# EAGLE design version1 (EAGLE 9.6.2)
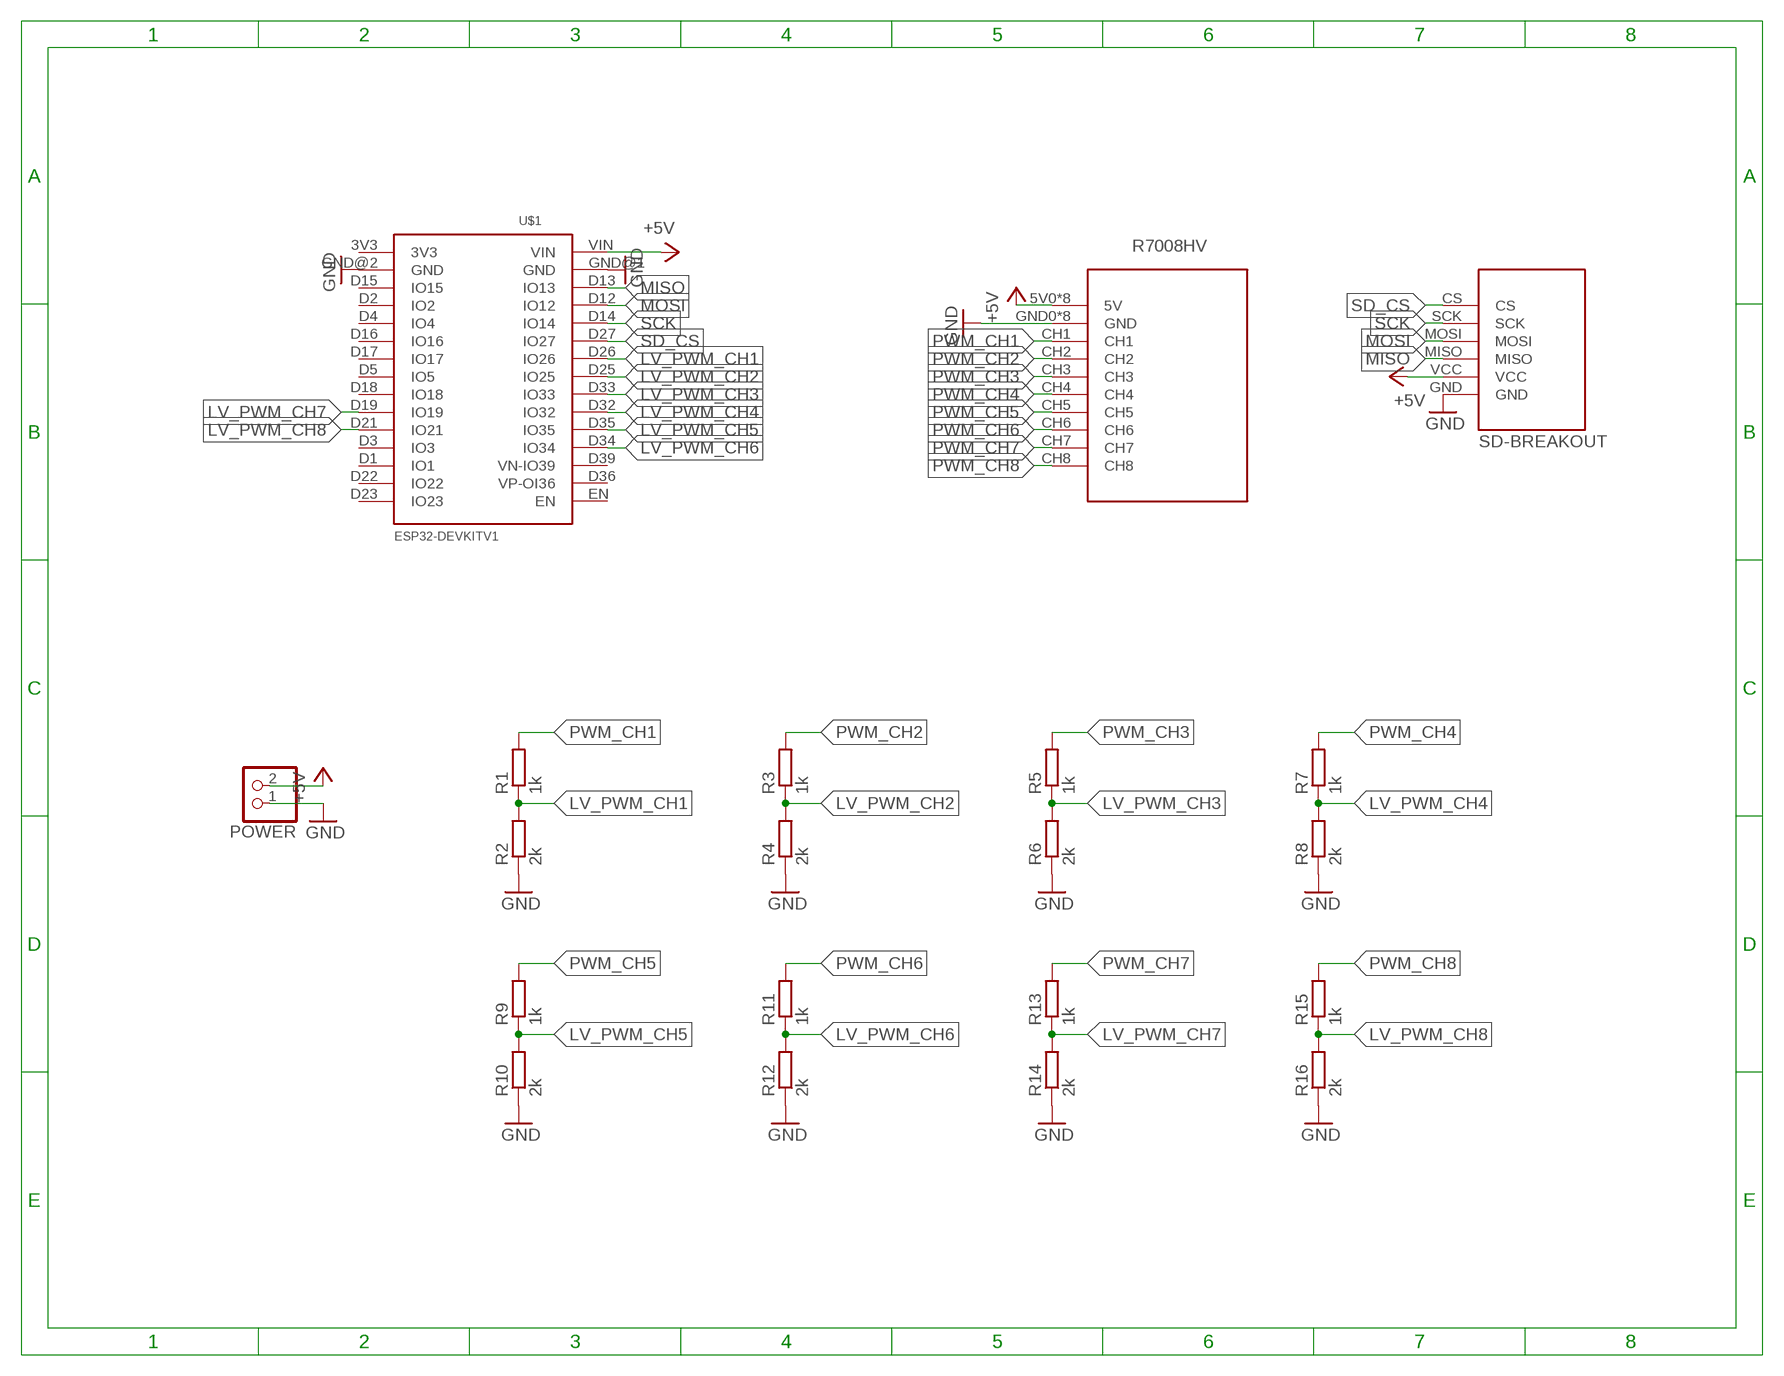
[diagram p0: schematic, sheet 1]

## Parts
POWER  PINHD-1X2  [1X02]
R1  1k  R-EU_0207/7  [0207/7]
R2  2k  R-EU_0207/7  [0207/7]
R3  1k  R-EU_0207/7  [0207/7]
R4  2k  R-EU_0207/7  [0207/7]
R5  1k  R-EU_0207/7  [0207/7]
R6  2k  R-EU_0207/7  [0207/7]
R7  1k  R-EU_0207/7  [0207/7]
R8  2k  R-EU_0207/7  [0207/7]
R9  1k  R-EU_0207/7  [0207/7]
R10  2k  R-EU_0207/7  [0207/7]
R11  1k  R-EU_0207/7  [0207/7]
R12  2k  R-EU_0207/7  [0207/7]
R13  1k  R-EU_0207/7  [0207/7]
R14  2k  R-EU_0207/7  [0207/7]
R15  1k  R-EU_0207/7  [0207/7]
R16  2k  R-EU_0207/7  [0207/7]
U$1  ESP32DEVKITV1  [ESP32-DEVKITV1]
U$2  HKD-MICRO-SD-BREAKOUTV  [HKD-MICRO-SD-BREAKOUT-VERTICAL]
U$3  R7008HV  [R7008HV]

## Nets
+5V: POWER.2 U$1.VIN U$2.VCC U$3.5V0(5V) U$3.5V1(5V) U$3.5V2(5V) U$3.5V3(5V) U$3.5V4(5V) U$3.5V5(5V) U$3.5V6(5V) U$3.5V7(5V)
GND: POWER.1 R2.1 R4.1 R6.1 R8.1 R10.1 R12.1 R14.1 R16.1 U$1.GND@1(GND) U$1.GND@2(GND) U$2.GND U$3.GND0(GND) U$3.GND1(GND) U$3.GND2(GND) U$3.GND3(GND) U$3.GND4(GND) U$3.GND5(GND) U$3.GND6(GND) U$3.GND7(GND)
LV_PWM_CH1: R1.1 R2.2 U$1.D26(IO26)
LV_PWM_CH2: R3.1 R4.2 U$1.D25(IO25)
LV_PWM_CH3: R5.1 R6.2 U$1.D33(IO33)
LV_PWM_CH4: R7.1 R8.2 U$1.D32(IO32)
LV_PWM_CH5: R9.1 R10.2 U$1.D35(IO35)
LV_PWM_CH6: R11.1 R12.2 U$1.D34(IO34)
LV_PWM_CH7: R13.1 R14.2 U$1.D19(IO19)
LV_PWM_CH8: R15.1 R16.2 U$1.D21(IO21)
MISO: U$1.D13(IO13) U$2.MISO
MOSI: U$1.D12(IO12) U$2.MOSI
PWM_CH1: R1.2 U$3.CH1
PWM_CH2: R3.2 U$3.CH2
PWM_CH3: R5.2 U$3.CH3
PWM_CH4: R7.2 U$3.CH4
PWM_CH5: R9.2 U$3.CH5
PWM_CH6: R11.2 U$3.CH6
PWM_CH7: R13.2 U$3.CH7
PWM_CH8: R15.2 U$3.CH8
SCK: U$1.D14(IO14) U$2.SCK
SD_CS: U$1.D27(IO27) U$2.CS
Unconnected: U$1.3V3 U$1.D1(IO1) U$1.D2(IO2) U$1.D3(IO3) U$1.D4(IO4) U$1.D5(IO5) U$1.D15(IO15) U$1.D16(IO16) U$1.D17(IO17) U$1.D18(IO18) U$1.D22(IO22) U$1.D23(IO23) U$1.D36(VP-OI36) U$1.D39(VN-IO39) U$1.EN

## Library data of the parts
POWER = pinhead:PINHD-1X2: PIN HEADER
R1-R16 = rcl:R-EU_: RESISTOR, European symbol; SPICEPREFIX: R
U$1 = ESP32-DEVKITV1:ESP32DEVKITV1
U$2 = sd-mmc:HKD-MICRO-SD-BREAKOUT
U$3 = radio-controllers:R7008HV

## Board
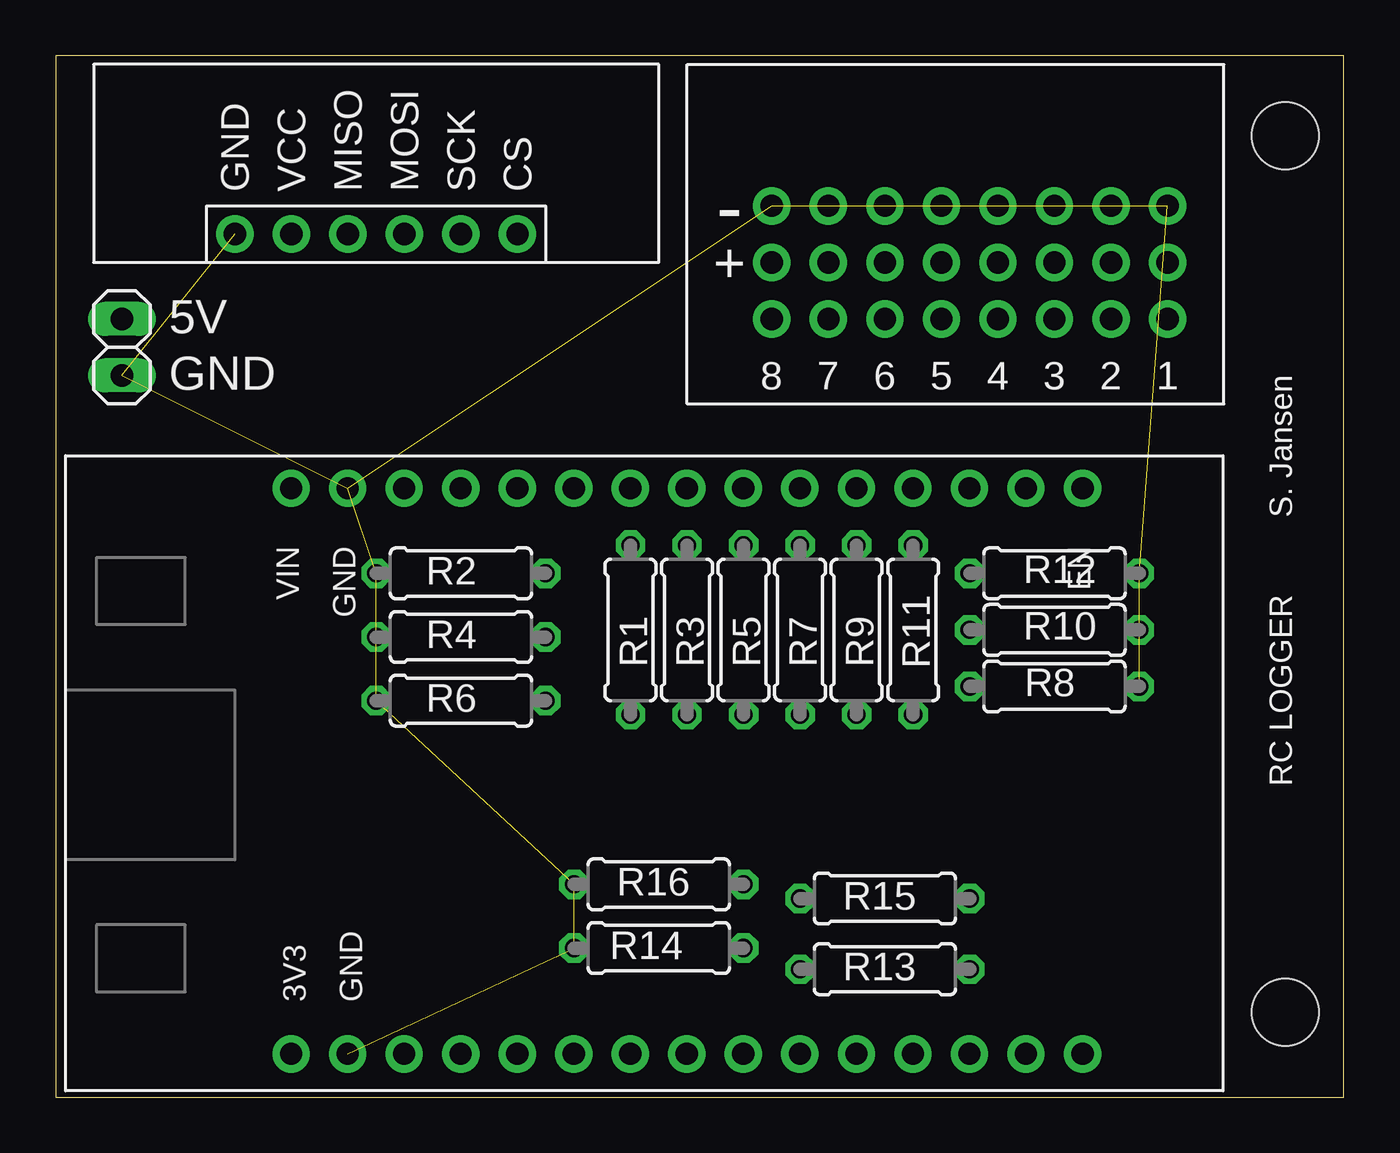
[diagram p1: board, top side]
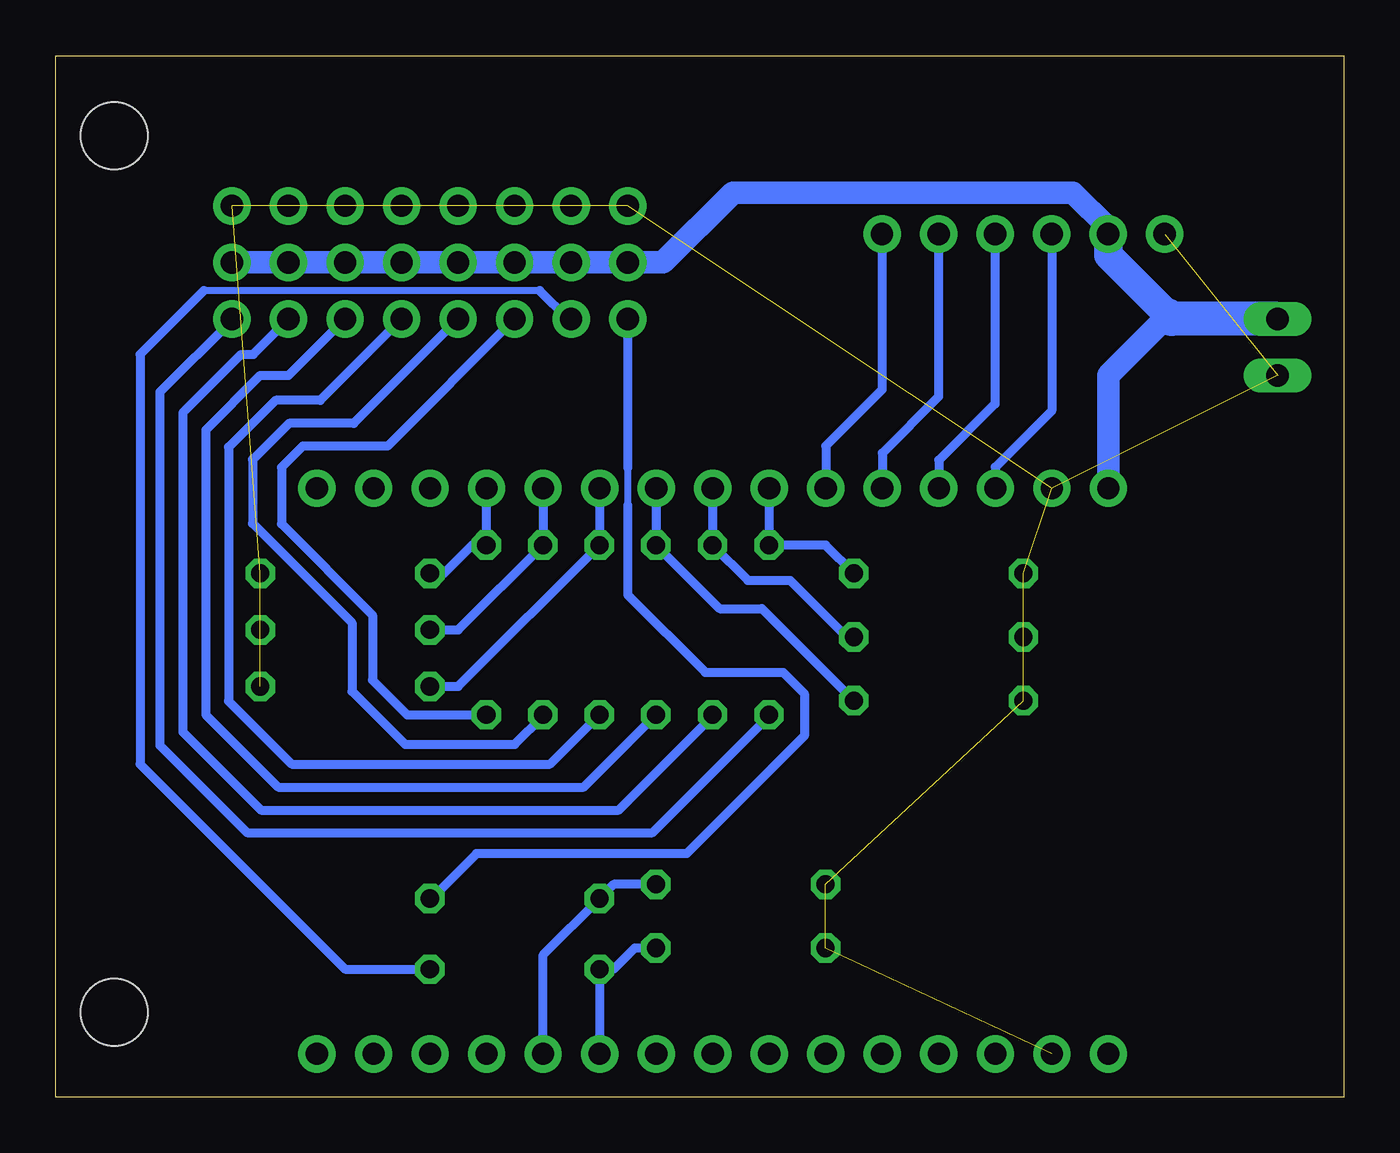
[diagram p2: board, bottom side, seen from below]

Size 57.89 x 46.78 mm. Coordinates in mm from the lower left corner, seen from the top.
Outline: 0,0 57.89,0 57.89,46.78 0,46.78 0,0
Copper layers (1*16): Top 0.035mm / dielectric 1.5mm / Bottom 0.035mm
Design rules "default *": minimum track width 8mil, minimum drill 0.35mm, track to track 8mil, track to pad 8mil, pad to pad 8mil, via to via 8mil, smd to smd 6mil, copper to edge 8mil, drill to drill 8mil, minimum pad ring 10mil, minimum via ring 8mil, stop-mask expansion 4mil, vias tented up to drill 0mil, thermal gap 10mil
Holes 3 mm at 55.24,43.18 55.24,3.81

### Footprints (pad centres in the part's own frame; a part is rotated, then mirrored left to right if it is on the bottom)
1X02 = drill 1.016 long: 1 -1.27,0; 2 1.27,0
0207/7 = drill 0.813 octagon: 1 -3.81,0; 2 3.81,0
ESP32-DEVKITV1 = drill 1 pad 1.676: 3V3 -15.25,-12.54; D1 15.23,-12.54; D2 -7.63,-12.54; D3 12.69,-12.54; D4 -5.09,-12.54; D5 2.53,-12.54; D12 -7.63,12.865; D13 -10.17,12.865; D14 -5.09,12.865; D15 -10.17,-12.54; D16 -2.55,-12.54; D17 -0.01,-12.54; D18 5.07,-12.54; D19 7.61,-12.54; D21 10.15,-12.54; D22 17.77,-12.54; D23 20.31,-12.54; D25 2.53,12.865; D26 -0.01,12.865; D27 -2.55,12.865; D32 7.61,12.865; D33 5.07,12.865; D34 12.69,12.865; D35 10.15,12.865; D36 17.77,12.865; D39 15.23,12.865; EN 20.31,12.865; GND@1 -12.71,12.865; GND@2 -12.71,-12.54; VIN -15.25,12.865
HKD-MICRO-SD-BREAKOUT-VERTICAL = drill 1 pad 1.676: CS -3.81,-6.35; GND -3.81,6.35; MISO -3.81,1.27; MOSI -3.81,-1.27; SCK -3.81,-3.81; VCC -3.81,3.81
R7008HV = drill 1 pad 1.676: 5V0 8.89,-1.27; 5V1 6.35,-1.27; 5V2 3.81,-1.27; 5V3 1.27,-1.27; 5V4 -1.27,-1.27; 5V5 -3.81,-1.27; 5V6 -6.35,-1.27; 5V7 -8.89,-1.27; CH1 8.89,-3.81; CH2 6.35,-3.81; CH3 3.81,-3.81; CH4 1.27,-3.81; CH5 -1.27,-3.81; CH6 -3.81,-3.81; CH7 -6.35,-3.81; CH8 -8.89,-3.81; GND0 8.89,1.27; GND1 6.35,1.27; GND2 3.81,1.27; GND3 1.27,1.27; GND4 -1.27,1.27; GND5 -3.81,1.27; GND6 -6.35,1.27; GND7 -8.89,1.27

### Placement (x,y rotation side)
POWER  2.97,33.68 90 top
R1  25.83,20.98 270 top
R2  18.21,23.52 0 top
R3  28.37,20.98 270 top
R4  18.21,20.66 0 top
R5  30.91,20.98 270 top
R6  18.21,17.81 0 top
R7  33.45,20.98 270 top
R8  44.88,18.44 180 top
R9  35.99,20.98 270 top
R10  44.88,20.98 180 top
R11  38.53,20.98 270 top
R12  44.88,23.52 180 top
R13  37.26,5.74 0 top
R14  27.1,6.69 0 top
R15  37.26,8.92 0 top
R16  27.1,9.55 0 top
U$1  25.83,14.48 0 top
U$2  14.4,42.57 90 top
U$3  41.07,38.76 0 top

### Tracks (layer width: path | path; a pad name or v marks a point on that pad's centre or on a via)
+5V
  Bottom 1.016: U$1.VIN 10.58,32.42 7.89,35.11 | U$2.VCC 10.59,39.05 12.17,40.63 27.46,40.63 30.59,37.49 U$3.5V7 U$3.5V6 U$3.5V5 U$3.5V4 U$3.5V3 U$3.5V2 U$3.5V1 U$3.5V0
  Bottom 1.27: U$2.VCC 10.59,37.81 7.89,35.11
  Bottom 1.524: 7.89,35.11 7.73,34.95 POWER.2
GND  (19 unrouted)
LV_PWM_CH1
  Bottom 0.406: U$1.D26 25.83,27.33 R1.1 23.29,24.79 R2.2
LV_PWM_CH2
  Bottom 0.406: U$1.D25 28.37,27.33 R3.1 26.78,23.2 24.88,23.2 22.34,20.66 R4.2
LV_PWM_CH3
  Bottom 0.406: U$1.D33 30.91,27.33 R5.1 28.05,21.93 26.15,21.93 R6.2
LV_PWM_CH4
  Bottom 0.406: U$1.D32 33.45,27.33 R7.1 39.8,18.44 R8.2
LV_PWM_CH5
  Bottom 0.406: U$1.D35 35.99,27.33 R9.1 39.8,20.98 R10.2
LV_PWM_CH6
  Bottom 0.406: R12.2 40.44,23.52 39.17,24.79 R11.1 U$1.D34
LV_PWM_CH7
  Bottom 0.406: R14.2 31.86,6.69 32.82,5.74 R13.1 33.45,1.95 U$1.D19
LV_PWM_CH8
  Bottom 0.406: R16.2 32.82,9.55 R15.1 35.98,6.38 U$1.D21
MISO
  Bottom 0.406: U$2.MISO 13.13,30.82 15.66,28.29 U$1.D13
MOSI
  Bottom 0.406: U$2.MOSI 15.67,31.14 18.2,28.61 U$1.D12
PWM_CH1
  Bottom 0.406: U$3.CH1 49.96,34.9 53.2,31.66 53.2,15.79 49.28,11.87 31.06,11.87 25.83,17.11 R1.2
PWM_CH2
  Bottom 0.406: U$3.CH2 49.01,33.36 49.54,33.36 52.17,30.73 52.17,16.4 48.66,12.89 32.59,12.89 28.37,17.11 R3.2
PWM_CH3
  Bottom 0.406: U$3.CH3 47.42,32.41 48.69,32.41 51.14,29.96 51.14,17.17 47.89,13.92 34.16,13.92 R5.2
PWM_CH4
  Bottom 0.406: U$3.CH4 46,31.29 48.01,31.29 50.11,29.19 50.11,17.79 47.28,14.95 35.67,14.95 R7.2
PWM_CH5
  Bottom 0.406: U$3.CH5 44.49,30.26 47.4,30.26 49.04,28.63 49.04,25.77 44.56,21.3 44.56,18.22 42.18,15.84 37.25,15.84 35.99,17.11 R9.2
PWM_CH6
  Bottom 0.406: U$3.CH6 42.98,29.23 46.79,29.23 47.74,28.28 47.74,25.74 43.64,21.65 43.64,18.73 42.09,17.17 R11.2
PWM_CH7
  Bottom 0.305: 36.14,36.22 51.23,36.22
  Bottom 0.406: U$3.CH7 34.87,34.95 36.14,36.22 | 51.23,36.22 54.09,33.36 54.09,14.95 44.88,5.74 R13.2
PWM_CH8
  Bottom 0.305: 32.18,28.27 32.18,26.57
  Bottom 0.406: R15.2 40.99,8.91 38.97,10.94 29.53,10.94 24.24,16.22 24.24,18.12 25.2,19.07 28.69,19.07 32.18,22.57 32.18,26.57 | U$3.CH8 32.18,28.27
SCK
  Bottom 0.406: U$2.SCK 18.21,31.46 20.74,28.93 U$1.D14
SD_CS
  Bottom 0.406: U$2.CS 20.75,31.77 23.28,29.25 U$1.D27

### Text on the board
tNames: 5V | GND | S. Jansen | RC LOGGER